# Altium schematic sheet Bus_Board.SchDoc
size A4
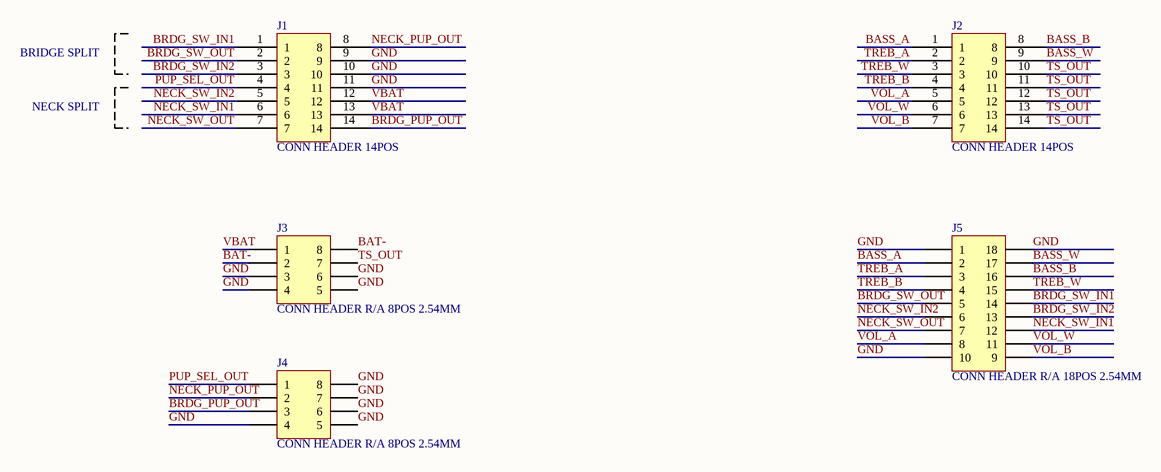
[diagram p0: Bus_Board.SchDoc]

## Parts
J1  CONN HEADER 14POS  [DF12(3.0)-14DP]
J2  CONN HEADER 14POS  [DF12(3.0)-14DP]
J3  CONN HEADER R/A 8POS 2.54MM  [CONN HEADER R/A 8POS 2.54MM]
J4  CONN HEADER R/A 8POS 2.54MM  [CONN HEADER R/A 8POS 2.54MM]
J5  CONN HEADER R/A 18POS 2.54MM  [CONN HEADER R/A 18POS 2.54MM]

## Nets
BASS_A: J2.1 J5.2
BASS_B: J2.8 J5.16
BASS_W: J2.9 J5.17
BAT-: J3.2 J3.8
BRDG_PUP_OUT: J1.14 J4.3
BRDG_SW_IN1: J1.1 J5.14
BRDG_SW_IN2: J1.3 J5.13
BRDG_SW_OUT: J1.2 J5.5
GND: J1.9 J1.10 J1.11 J3.3 J3.4 J3.5 J3.6 J4.4 J4.5 J4.6 J4.7 J4.8 J5.1 J5.10 J5.18
NECK_PUP_OUT: J1.8 J4.2
NECK_SW_IN1: J1.6 J5.12
NECK_SW_IN2: J1.5 J5.6
NECK_SW_OUT: J1.7 J5.7
PUP_SEL_OUT: J1.4 J4.1
TREB_A: J2.2 J5.3
TREB_B: J2.4 J5.4
TREB_W: J2.3 J5.15
TS_OUT: J2.10 J2.11 J2.12 J2.13 J2.14 J3.7
VBAT: J1.12 J1.13 J3.1
VOL_A: J2.5 J5.8
VOL_B: J2.7 J5.9
VOL_W: J2.6 J5.11

## Notes on the sheet
- BRIDGE SPLIT
- NECK SPLIT

## Library data of the parts
J1 J2 = DF12(3.0)-14DP-0.5V(86): 14 Position Connector Header, Outer Shroud Contacts Surface Mount Gold; Manufacturer: Hirose; Digikey Part Number: H11701CT-ND
J3 J4 = CONN HEADER R/A 8POS 2.54MM: Connector Header Through Hole, Right Angle 8 position 0.100" (2.54mm); Manufacturer: Samtec Inc.; Digikey Part Number: SAM12315-ND
J5 = CONN HEADER R/A 18POS 2.54MM: Connector Header Through Hole, Right Angle 18 position 0.100" (2.54mm); Manufacturer: Samtec Inc.; Digikey Part Number: SAM1041-09-ND